# Altium schematic sheet ESP32_LoRa_1_Channel_Gateway.SchDoc: ESP32_LoRa_1_Channel_Gateway
size 270 x 205 mm; Date: 11/14/2018 10:36:42 AM; SheetNumber: 1; Origin: Eagle; GateName_1: G$1; SymbolName_1: FRAME-LETTER; LibraryName: SparkFun-Aesthetics; DeviceSetName: FRAME-LETTER; GateName_2: V; SymbolName_2: DOCFIELD; Sheet: Sheet:; REV: REV:; ReleasedundertheCreativeCommons: Released under the Creative Commons; AttributionShare-Alike4.0License: Attribution Share-Alike 4.0 License; https://creativecommons.org/licenses/by-sa/4.0/: https://creativecommons.org/licenses/by-sa/4.0/; Designby: Design by:
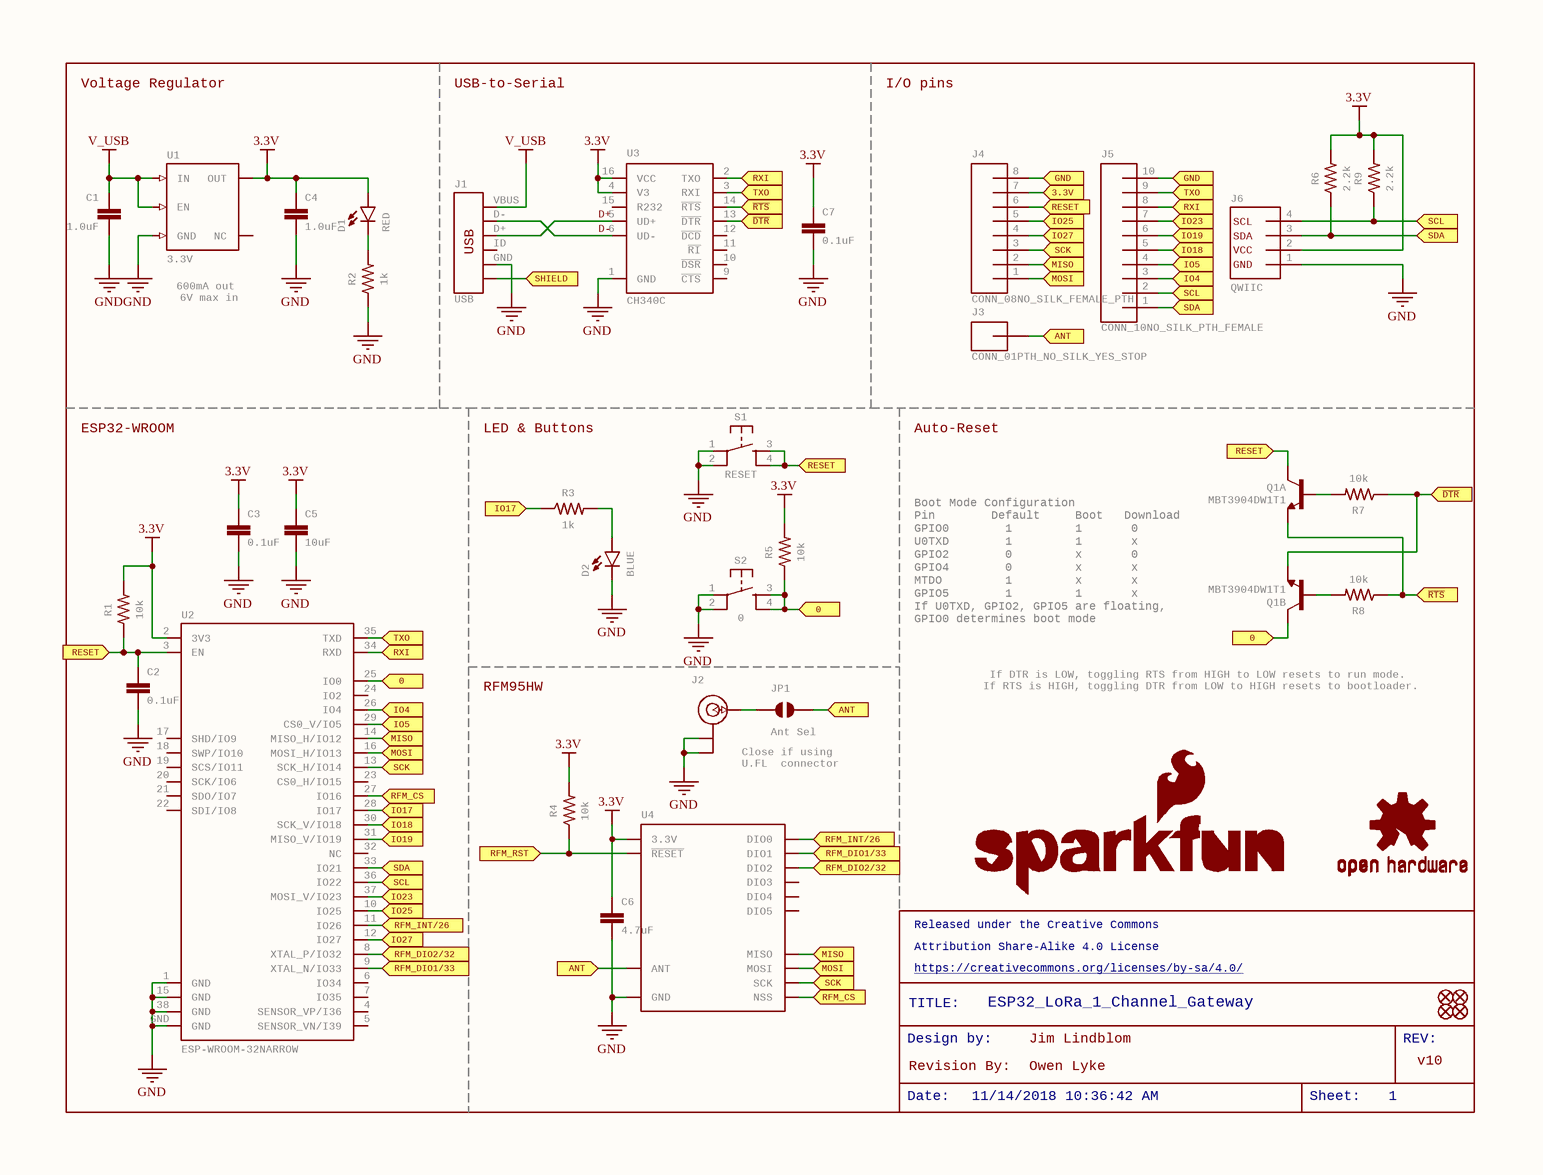
[diagram p0: ESP32_LoRa_1_Channel_Gateway.SchDoc]

## Parts
C1  1.0uF  [0603]
C2  0.1uF  [0603]
C3  0.1uF  [0603]
C4  1.0uF  [0603]
C5  10uF  [0603]
C6  4.7uF  [0603]
C7  0.1uF  [0603]
D1  RED  [LED-0603]
D2  BLUE  [LED-0603]
FD1  FIDUCIAL1X2  [FIDUCIAL-1X2]  (value not drawn)
FD2  FIDUCIAL1X2  [FIDUCIAL-1X2]  (value not drawn)
FD3  FIDUCIAL1X2  [FIDUCIAL-1X2]  (value not drawn)
FD4  FIDUCIAL1X2  [FIDUCIAL-1X2]  (value not drawn)
J1  USB  [USB-MICROB-PTH-MILL]
J2  U.FL  [U.FL]  (value not drawn)
J3  CONN_01PTH_NO_SILK_YES_STOP  [1X01_NO_SILK]
J4  CONN_08NO_SILK_FEMALE_PTH  [1X08_NO_SILK]
J5  CONN_10NO_SILK_PTH_FEMALE  [1X10_NO_SILK]
J6  QWIIC  [1X04_1MM_RA]
JP1  Ant Sel  [SMT-JUMPER_2_NO_NO-SILK]
LOGO1  RevisionBy: Revision By:  [REVISION]  (hidden comment: REVISION)
LOGO2  SFE_LOGO_NAME_FLAME.1_INCH  [SFE_LOGO_NAME_FLAME_.1]  (value not drawn)
LOGO3  OSHW-LOGOS  [OSHW-LOGO-S]  (value not drawn)
Q1  MBT3904DW1T1  [SC70-6]  (parts A,B of 2)
R1  10k  [0603]
R2  1k  [0603]
R3  1k  [0603]
R4  10k  [0603]
R5  10k  [0603]
R6  2.2k  [0603]
R7  10k  [0603]
R8  10k  [0603]
R9  2.2k  [0603]
S1  RESET  [TACTILE_SWITCH_SMD_4.6X2.8MM]
S2  0  [TACTILE_SWITCH_SMD_4.6X2.8MM]
U1  3.3V  [SOT23-5]
U2  ESP-WROOM-32NARROW  [ESP-WROOM-32-NARROW]
U3  CH340C  [SO016]
U4  RFM95W  [RFM95/96/97/98W]  (value not drawn)

## Ports
0 (in), 3.3V (in), ANT (in), GND (in), IO4 (in), IO5 (in), IO17 (in), IO18 (in), IO19 (in), IO23 (in), IO25 (in), IO27 (in), MISO (in), MOSI (in), RESET (in), RFM_CS (in), RFM_DIO1/33 (in), RFM_DIO2/32 (in), RFM_INT/26 (in), RFM_RST (in), RXI (in), SCK (in), SCL (in), SDA (in), SHIELD (in), TXO (in), ~{DTR} (in), ~{RTS} (in)

## Nets
3.3V: C3.1 C4.1 C5.1 C6.1 C7.1 D1.A J6.2 R1.2 R4.2 R5.2 R6.2 R9.2 U1.5(OUT) U2.2(3V3) U3.4(V3) U3.16(VCC) U4.3.3V
GND: C1.2 C2.2 C3.2 C4.2 C5.2 C6.2 C7.2 D2.C J1.GND J2.1(GND) J2.2(GND) J6.1 R2.1 S1.1 S1.2 S2.1 S2.2 U1.2(GND) U2.1(GND) U2.15(GND) U2.38(GND) U2.GND U3.1(GND) U4.GND@1_GND@2_GND@3(GND)
V_USB: C1.1 J1.VBUS U1.1(IN) U1.3(EN)
0: Q1.6(C) R5.1 S2.3 S2.4 U2.25(IO0) ; port 0
3.3V: J4.7 ; port 3.3V  [a separate net that carries the same name]
ANT: J3.1 JP1.2 U4.ANT ; port ANT
D+: J1.D+ U3.5(UD+)
D-: J1.D- U3.6(UD-)
~{DTR}: Q1.1(E) R7.1 U3.13(~{DTR}) ; port ~{DTR}
GND: J4.8 J5.10 ; port GND  [a separate net that carries the same name]
IO4: J5.3 U2.26(IO4) ; port IO4
IO5: J5.4 U2.29(CS0_V/IO5) ; port IO5
IO17: R3.1 U2.28(IO17) ; port IO17
IO18: J5.5 U2.30(SCK_V/IO18) ; port IO18
IO19: J5.6 U2.31(MISO_V/IO19) ; port IO19
IO23: J5.7 U2.37(MOSI_V/IO23) ; port IO23
IO25: J4.5 U2.10(IO25) ; port IO25
IO27: J4.4 U2.12(IO27) ; port IO27
MISO: J4.2 U2.14(MISO_H/IO12) U4.MISO ; port MISO
MOSI: J4.1 U2.16(MOSI_H/IO13) U4.MOSI ; port MOSI
~{RTS}: Q1.4(E) R8.1 U3.14(~{RTS}) ; port ~{RTS}
RESET: C2.1 J4.6 Q1.3(C) R1.1 S1.3 S1.4 U2.3(EN) ; port RESET
RFM_CS: U2.27(IO16) U4.NSS ; port RFM_CS
RFM_DIO1/33: U2.9(XTAL_N/IO33) U4.DIO1 ; port RFM_DIO1/33
RFM_DIO2/32: U2.8(XTAL_P/IO32) U4.DIO2 ; port RFM_DIO2/32
RFM_INT/26: U2.11(IO26) U4.DIO0 ; port RFM_INT/26
RFM_RST: R4.1 U4.!RESET(~{RESET}) ; port RFM_RST
RXI: J5.8 U2.34(RXD) U3.2(TXO) ; port RXI
SCK: J4.3 U2.13(SCK_H/IO14) U4.SCK ; port SCK
SCL: J5.2 J6.4 R9.1 U2.36(IO22) ; port SCL
SDA: J5.1 J6.3 R6.1 U2.33(IO21) ; port SDA
SHIELD: J1.SHIELD_SHIELD2_SHIELD3_SHIELD4_SHIELD5_SHIELD6_SHIELD7_SHIELD8_SHIELD9_SHIELD10(SHIELD) ; port SHIELD
TXO: J5.9 U2.35(TXD) U3.3(RXI) ; port TXO
NetD1_C: D1.C R2.2
NetD2_A: D2.A R3.2
NetJ2_FEED: J2.FEED(SIGNAL) JP1.1
NetQ1_2: Q1.2(B) R8.2
NetQ1_5: Q1.5(B) R7.2

Not connected (* = marked no-connect by the designer): J1 ID; U1 4(NC); U2 4(SENSOR_VP/I36) 5(SENSOR_VN/I39) 6(IO34) 7(IO35) 17(SHD/IO9) 18(SWP/IO10) 19(SCS/IO11) 20(SCK/IO6) 21(SDO/IO7) 22(SDI/IO8) 23(CS0_H/IO15) 24(IO2) 32(NC); U3 9(~{CTS}) 10(~{DSR}) 11(~{RI}) 12(~{DCD}) 15(R232); U4 DIO3 DIO4 DIO5

## Notes on the sheet
- Voltage Regulator
- USB-to-Serial
- I/O pins
- (near U1) 600mA out
  6V max in
- ESP32-WROOM
- LED & Buttons
- Auto-Reset
- (near Q1) Boot Mode Configuration
  Pin        Default     Boot   Download
  GPIO0        1         1       0
  U0TXD        1         1       x
  GPIO2        0         x       0
  GPIO4        0         x       x
  MTDO         1         x       x
  GPIO5        1         1       x
  If U0TXD, GPIO2, GPIO5 are floating,
  GPIO0 determines boot mode
- RFM95HW
- If DTR is LOW, toggling RTS from HIGH to LOW resets to run mode.
  If RTS is HIGH, toggling DTR from LOW to HIGH resets to bootloader.
- Close if using
  U.FL  connector
- (near LOGO2) Released under the Creative Commons
- (near LOGO2) Attribution Share-Alike 4.0 License
- https://creativecommons.org/licenses/by-sa/4.0/
- (near LOGO1) Design by:
- TITLE:
- ESP32_LoRa_1_Channel_Gateway
- Jim Lindblom
- REV:
- (near LOGO1) Date:
- 11/14/2018 10:36:42 AM
- Owen Lyke
- Sheet:
- 1
- v10

## Library data of the parts
C1 C4 = 1.0UF-0603-16V-10%: 1ÂµF ceramic capacitors    A capacitor is a passive two-terminal electrical component used to store electrical energy temporarily in an electric field.; GateName_1: G$1; SymbolName_1: CAP; PROD_ID: CAP-00868; DeviceName: -0603-16V-10%; LibraryName: SparkFun-Capacitors; DeviceSetName: 1.0UF
C2 C3 = 0.1UF-0603-25V-(+80/-20%): 0.1ÂµF ceramic capacitors    A capacitor is a passive two-terminal electrical component used to store electrical energy temporarily in an electric field.; GateName_1: G$1; SymbolName_1: CAP; PROD_ID: CAP-00810; DeviceName: -0603-25V-(+80/-20%); LibraryName: SparkFun-Capacitors; DeviceSetName: 0.1UF
C5 = 10UF-0603-6.3V-20%: 10.0ÂµF ceramic capacitors    A capacitor is a passive two-terminal electrical component used to store electrical energy temporarily in an electric field.; GateName_1: G$1; SymbolName_1: CAP; PROD_ID: CAP-11015; DeviceName: -0603-6.3V-20%; LibraryName: SparkFun-Capacitors; DeviceSetName: 10UF
C6 = 4.7UF-0603-6.3V-(10%): 4.7ÂµF ceramic capacitors    A capacitor is a passive two-terminal electrical component used to store electrical energy temporarily in an electric field.; GateName_1: G$1; SymbolName_1: CAP; PROD_ID: CAP-08280; DeviceName: -0603-6.3V-(10%); LibraryName: SparkFun-Capacitors; DeviceSetName: 4.7UF
C7 = 0.1UF-0603-25V-5%: 0.1ÂµF ceramic capacitors    A capacitor is a passive two-terminal electrical component used to store electrical energy temporarily in an electric field.; GateName_1: G$1; SymbolName_1: CAP; PROD_ID: CAP-08604; DeviceName: -0603-25V-5%; LibraryName: SparkFun-Capacitors; DeviceSetName: 0.1UF
D1 = LED-RED0603: Red SMD LED    Used in manufacturing of most products at SparkFun   Packages: 0603 - SMD 0603 package [Product Link]  0603 SMART - SMD 0603 SMART package ( more efficient and expensive)[Product Link]   1206 - SMD1206  package [Product Link]    SparkFun Products: Pro Mini 328 -5V  RedBoard  IOIO-OTG; GateName_1: G$1; DeviceName: 0603; PROD_ID: DIO-00819; SymbolName_1: LED; LibraryName: SparkFun-LED; DeviceSetName: LED-RED
D2 = LED-BLUE0603: Blue SMD LED    Used in manufacturing of various products at SparkFun   Packages: 0603 - SMD 0603 package [Product Link]  1206 - SMD1206  package [Product Link]    SparkFun Products: ESP8266 Thing-Dev Board  RedBoard; GateName_1: G$1; DeviceName: 0603; PROD_ID: DIO-08575; SymbolName_1: LED; LibraryName: SparkFun-LED; DeviceSetName: LED-BLUE
FD1-FD4 = FIDUCIAL1X2: Fiducial Alignment Points    Point-of-reference for pick-and-place machines and other optical instruments.; GateName_1: G$1; DeviceName: 1X2; SymbolName_1: FIDUCIAL; LibraryName: SparkFun-Aesthetics; DeviceSetName: FIDUCIAL
J1 = USB_MICRO-B_HALF_PTH_MILL: USB Type Micro-B Connector    Male/female and PTH/SMT variants   SparkFun Products:  SparkFun microB USB Breakout  SparkFun USB microB Plug Breakout  SparkFun ESP8266 Thing; GateName_1: J1; SymbolName_1: USB-5PIN; PROD_ID: CONN-13711; DeviceName: _HALF_PTH_MILL; LibraryName: SparkFun-Connectors; DeviceSetName: USB_MICRO-B; USB: USB
J2 = U.FL: SMD Antenna Connector - U.FL    2mm height, 3.0mm x 3.0mm receptacle size.    SparkFun Products: SparkFun WiFi Shield - ESP8266  SparkFun ESP8266 Thing  SparkFun MiniGen - Pro Mini Signal Generator Shield; GateName_1: G$1; PROD_ID: CONN-09193; SF_ID: WRL-09144; SymbolName_1: U.FL; LibraryName: SparkFun-Connectors; DeviceSetName: U.FL
J3 = CONN_01PTH_NO_SILK_YES_STOP: Single connection point. Often used as Generic Header-pin footprint for 0.1 inch spaced/style header connections       On any of the 0.1 inch spaced packages, you can populate with these:   Break Away Headers - Straight (PRT-00116)   Break Away Male Headers - Right Angle (PRT-00553)   Female Headers (PRT-00115)   Break Away Headers - Machine Pin (PRT-00117)   Break Away Female Headers - Swiss Machine Pin (PRT-00743)          This device is also useful as a general connection point to wire up your design to another part of your project. Our various solder wires solder well into these plated through hole pads.   Hook-Up Wire - Assortment (Stranded, 22 AWG) (PRT-11375)   Hook-Up Wire - Assortment (Solid Core, 22 AWG) (PRT-11367)   View the entire wire category on our website here          Special notes:    SMTSO-256-ET is a "flush mount" nut for a 4-40 screw. We mostly use this on specialty testbeds; it is a nice way to connect hardware to your PCB at an adjustable hieght.    Also note, the SNAP packages are for using a snappable style connector. We sell a baggie of snaps and they are also used on two LilyPad designs:   Snap Assortment - 30 pack (male and female) (DEV-11347)  LilyPad Arduino SimpleSnap (DEV-10941)   LilyPad SimpleSnap Protoboard (DEV-10940); GateName_1: G$1; SymbolName_1: CONN_01; DeviceName: PTH_NO_SILK_YES_STOP; LibraryName: SparkFun-Connectors; DeviceSetName: CONN_01
J4 = CONN_08NO_SILK_FEMALE_PTH: Multi connection point. Often used as Generic Header-pin footprint for 0.1 inch spaced/style header connections    On any of the 0.1 inch spaced packages, you can populate with these:  Break Away Headers - Straight (PRT-00116)   Break Away Male Headers - Right Angle (PRT-00553)   Female Headers (PRT-00115)   Break Away Headers - Machine Pin (PRT-00117)   Break Away Female Headers - Swiss Machine Pin (PRT-00743)   Arduino Stackable Header - 8 Pin (PRT-09279)        For SCREWTERMINALS and SPRING TERMINALS visit here:  Screw Terimnals on SparkFun.com (5mm/3.5mm/2.54mm spacing)       This device is also useful as a general connection point to wire up your design to another part of your project. Our various solder wires solder well into these plated through hole pads.  Hook-Up Wire - Assortment (Stranded, 22 AWG) (PRT-11375)   Hook-Up Wire - Assortment (Solid Core, 22 AWG) (PRT-11367)   View the entire wire category on our website here          Special notes:     Molex polarized connector foot print use with SKU : PRT-08231 with associated crimp pins and housings. 1MM SMD Version SKU: PRT-10208    NOTES ON THE VARIANTS LOCK and LOCK_LONGPADS... This footprint was designed to help hold the alignment of a through-hole component (i.e.  6-pin header) while soldering it into place. You may notice that each hole has been shifted either up or down by 0.005 of an inch from it's more standard position (which is a perfectly straight line).  This slight alteration caused the pins (the squares in the middle) to touch the edges of the holes.  Because they are alternating, it causes a "brace" to hold the component in place.  0.005 has proven to be the perfect amount of "off-center" position when using our standard breakaway headers. Although looks a little odd when you look at the bare footprint, once you have a header in there, the alteration is very hard to notice.  Also,if you push a header all the way into place, it is covered up entirely on the bottom side.; GateName_1: G$1; PROD_ID: CONN-08438; SymbolName_1: CONN_08; DeviceName: NO_SILK_FEMALE_PTH; LibraryName: SparkFun-Connectors; DeviceSetName: CONN_08
J5 = CONN_10NO_SILK_PTH_FEMALE: Multi connection point. Often used as Generic Header-pin footprint for 0.1 inch spaced/style header connections    On any of the 0.1 inch spaced packages, you can populate with these:  Break Away Headers - Straight (PRT-00116)   Break Away Male Headers - Right Angle (PRT-00553)   Female Headers (PRT-00115)   Break Away Headers - Machine Pin (PRT-00117)   Break Away Female Headers - Swiss Machine Pin (PRT-00743)   Arduino Stackable Header - 10 Pin (PRT-11376)        For SCREWTERMINALS and SPRING TERMINALS visit here:  Screw Terimnals on SparkFun.com (5mm/3.5mm/2.54mm spacing)       This device is also useful as a general connection point to wire up your design to another part of your project. Our various solder wires solder well into these plated through hole pads.  Hook-Up Wire - Assortment (Stranded, 22 AWG) (PRT-11375)   Hook-Up Wire - Assortment (Solid Core, 22 AWG) (PRT-11367)   View the entire wire category on our website here          Special notes:     Molex polarized connector foot print use with SKU : PRT-08231 with associated crimp pins and housings. 1MM SMD Version SKU: PRT-10208    NOTES ON THE VARIANTS LOCK and LOCK_LONGPADS... This footprint was designed to help hold the alignment of a through-hole component (i.e.  6-pin header) while soldering it into place. You may notice that each hole has been shifted either up or down by 0.005 of an inch from it's more standard position (which is a perfectly straight line).  This slight alteration caused the pins (the squares in the middle) to touch the edges of the holes.  Because they are alternating, it causes a "brace" to hold the component in place.  0.005 has proven to be the perfect amount of "off-center" position when using our standard breakaway headers. Although looks a little odd when you look at the bare footprint, once you have a header in there, the alteration is very hard to notice.  Also,if you push a header all the way into place, it is covered up entirely on the bottom side.; GateName_1: G$1; PROD_ID: CONN-11563; SymbolName_1: CONN_10; DeviceName: NO_SILK_PTH_FEMALE; LibraryName: SparkFun-Connectors; DeviceSetName: CONN_10
J6 = QWIIC_CONNECTORJS-1MM: SparkFun I2C Standard Qwiic Connector An SMD 1mm pitch JST connector makes it easy and quick (get it? Qwiic?) to connect I2C devices to each other. The Qwiic system enables fast and solderless connection between popular platforms and various sensors and actuators.   We carry 200mm, 100mm, 50mm, and breadboard friendly Qwiic cables. We also offer 10 pcs strips the SMD connectors.; GateName_1: G$1; SymbolName_1: I2C_STANDARD; DeviceName: JS-1MM; PROD_ID: CONN-13694; LibraryName: SparkFun-Connectors; DeviceSetName: QWIIC_CONNECTOR; SDA: SDA; VCC: VCC; GND: GND; SCL: SCL
JP1 = JUMPER-SMT_2_NO_NO-SILK: Normally open jumper    This jumper has two pads in close proximity to each other. Apply solder to close the connection.   Round pads are easier to solder for beginners, but are a lot larger.   SparkFun Product that uses the round pads:  SparkFun EL Sequencer; GateName_1: G$1; SymbolName_1: SMT-JUMPER_2_NO; DeviceName: _NO-SILK; LibraryName: SparkFun-Jumpers; DeviceSetName: JUMPER-SMT_2_NO
LOGO1 = REVISION: "Revision By" Text    Preceding text for revisor documentation. Includes schematic text on "symbols" layer, and board text on tDoc.; GateName_1: G$1; SymbolName_1: REVISION; LibraryName: SparkFun-Aesthetics; DeviceSetName: REVISION
LOGO2 = SFE_LOGO_NAME_FLAME.1_INCH: SparkFun Font Logo w/ Flame    This is the SparkFun full logo. The logo on the schematic will always be the same size; the package variant is the height of the flame part of the logo. Default layer for the logo on the board is tSilk.; GateName_1: G$1; SymbolName_1: SFE_LOGO_NAME_FLAME; DeviceName: .1_INCH; LibraryName: SparkFun-Aesthetics; DeviceSetName: SFE_LOGO_NAME_FLAME
LOGO3 = OSHW-LOGOS: Open-Source Hardware (OSHW) Logo     This logo indicates the piece of hardware it is found on incorporates a OSHW license and/or adheres to the definition of open source hardware found here: http://freedomdefined.org/OSHW; GateName_1: G$1; DeviceName: S; SymbolName_1: OSHW-LOGO; LibraryName: SparkFun-Aesthetics; DeviceSetName: OSHW-LOGO
Q1 = TRANS_NPN_DUAL-MBT3904DW1T1: Dual NPN Transistors in Single Package    The MBT3904W1 puts two general purpose 3904 NPN transistors in a single package.   Datasheet   SparkFun Products: SparkFun ESP32 Thing; GateName_1: Q1; GateName_2: Q2; PROD_ID: TRANS-13337; SymbolName_1: NPN; SymbolName_2: NPN; DeviceName: -MBT3904DW1T1; LibraryName: SparkFun-DiscreteSemi; DeviceSetName: TRANS_NPN_DUAL
R1 R4 R5 R7 R8 = 10KOHM-0603-1/10W-1%: 10kÎ© resistor    A resistor is a passive two-terminal electrical component that implements electrical resistance as a circuit element. Resistors act to reduce current flow, and, at the same time, act to lower voltage levels within circuits. - Wikipedia; GateName_1: G$1; DeviceSetName: 10KOHM; PROD_ID: RES-00824; SymbolName_1: RESISTOR; DeviceName: -0603-1/10W-1%; LibraryName: SparkFun-Resistors
R2 R3 = 1KOHM-0603-1/10W-1%: 1kÎ© resistor    A resistor is a passive two-terminal electrical component that implements electrical resistance as a circuit element. Resistors act to reduce current flow, and, at the same time, act to lower voltage levels within circuits. - Wikipedia; GateName_1: G$1; DeviceSetName: 1KOHM; PROD_ID: RES-07856; SymbolName_1: RESISTOR; DeviceName: -0603-1/10W-1%; LibraryName: SparkFun-Resistors
R6 R9 = 2.2KOHM-0603-1/10W-1%: 2.2kÎ© resistor    A resistor is a passive two-terminal electrical component that implements electrical resistance as a circuit element. Resistors act to reduce current flow, and, at the same time, act to lower voltage levels within circuits. - Wikipedia; GateName_1: G$1; PROD_ID: RES-08272; SymbolName_1: RESISTOR; DeviceName: -0603-1/10W-1%; LibraryName: SparkFun-Resistors; DeviceSetName: 2.2KOHM
S1 S2 = MOMENTARY-SWITCH-SPST-2-SMD-4.6X2.8MM: Momentary Switch (Pushbutton) - SPST - Two Circuits    Normally-open (NO) SPST momentary switches (buttons, pushbuttons). Schematic symbol includes two switch circuits. Variants  SMD-4.6MMX2.8MM -  4.60mm x 2.80mm Tactile Momentary Button Switch  - Used on SparkFun SAMD21 Mini Breakout  SMD-5.2MM - Mini Pushbutton Switch - SMD - Used on Arduino Pro Mini; GateName_1: G$1; SymbolName_1: SWITCH-MOMENTARY; PROD_ID: SWCH-13065; DeviceName: -SMD-4.6X2.8MM; LibraryName: SparkFun-Switches; DeviceSetName: MOMENTARY-SWITCH-SPST-2
U1 = V_REG_AP2112K-3.3V: AP2112 - 600mA CMOS LDO Regulator w/ Enable    The AP2112 is CMOS process low dropout linear regulator with enable function, the regulator delivers a guaranteed 600mA (min.) continuous load current.   Features  Output Voltage Accuracy: Â±1.5%   Output Current: 600mA (Min.)   Foldback Short Current Protection: 50mA   Enable Function to Turn ON/OFF VOUT  Low Dropout Voltage (3.3V): 250mV (Typ.) @IOUT=600mA   Excellent Load Regulation: 0.2%/A (Typ.)   Excellent Line Regulation: 0.02%/V (Typ.)   Low Quiescent Current: 55Î¼A (Typ.)  Low Standby Current: 0.01Î¼A (Typ.)  Low Output Noise: 50Î¼VRMS   PSRR: 100Hz -65dB, 1kHz -65dB    OTSD Protection   Stable  with  1.0Î¼F Flexible Cap: Ceramic, Tantalum and Aluminum Electrolytic   Operation Temperature Range: -40Â°C to 85Â°C   ESD: MM 400V, HBM 4000V; GateName_1: G$1; SymbolName_1: V-REG-LDO_NO-BP; DeviceName: K-3.3V; PROD_ID: VREG-12457; LibraryName: SparkFun-IC-Power; DeviceSetName: V_REG_AP2112
U2 = ESP-WROOM-32NARROW: GateName_1: G$1; DeviceName: NARROW; PROD_ID: IC-13849; SymbolName_1: ESP-WROOM-32; LibraryName: SparkFun-RF; DeviceSetName: ESP-WROOM-32
U3 = CH340C: GateName_1: U1; PROD_ID: IC-14038; SymbolName_1: CH340C; LibraryName: SparkFun-IC-Comms; DeviceSetName: CH340C
U4 = RFM95W: RFM95/96/97/98    The RFM95/96/97/98(W) transceivers feature the LoRaTM    long range modem that provides ultra-long range spread spectrum communication and high interference immunity whilst minimising current consumption.    These devices also support high performance (G)FSK modes for systems including WMBus, IEEE802.15.4g. The RFM95/96/97/98(W) deliver exceptional phase noise, selectivity, receiver linearity and IIP3 for significantly lower current consumption than competing devices   Datasheet; GateName_1: G$1; PROD_ID: IC-13959; SymbolName_1: RFM95W; LibraryName: SparkFun-RF; DeviceSetName: RFM95W